# EAGLE schematic eggbothat2 (EAGLE 7.7.0)

## Sheet 1 of 2
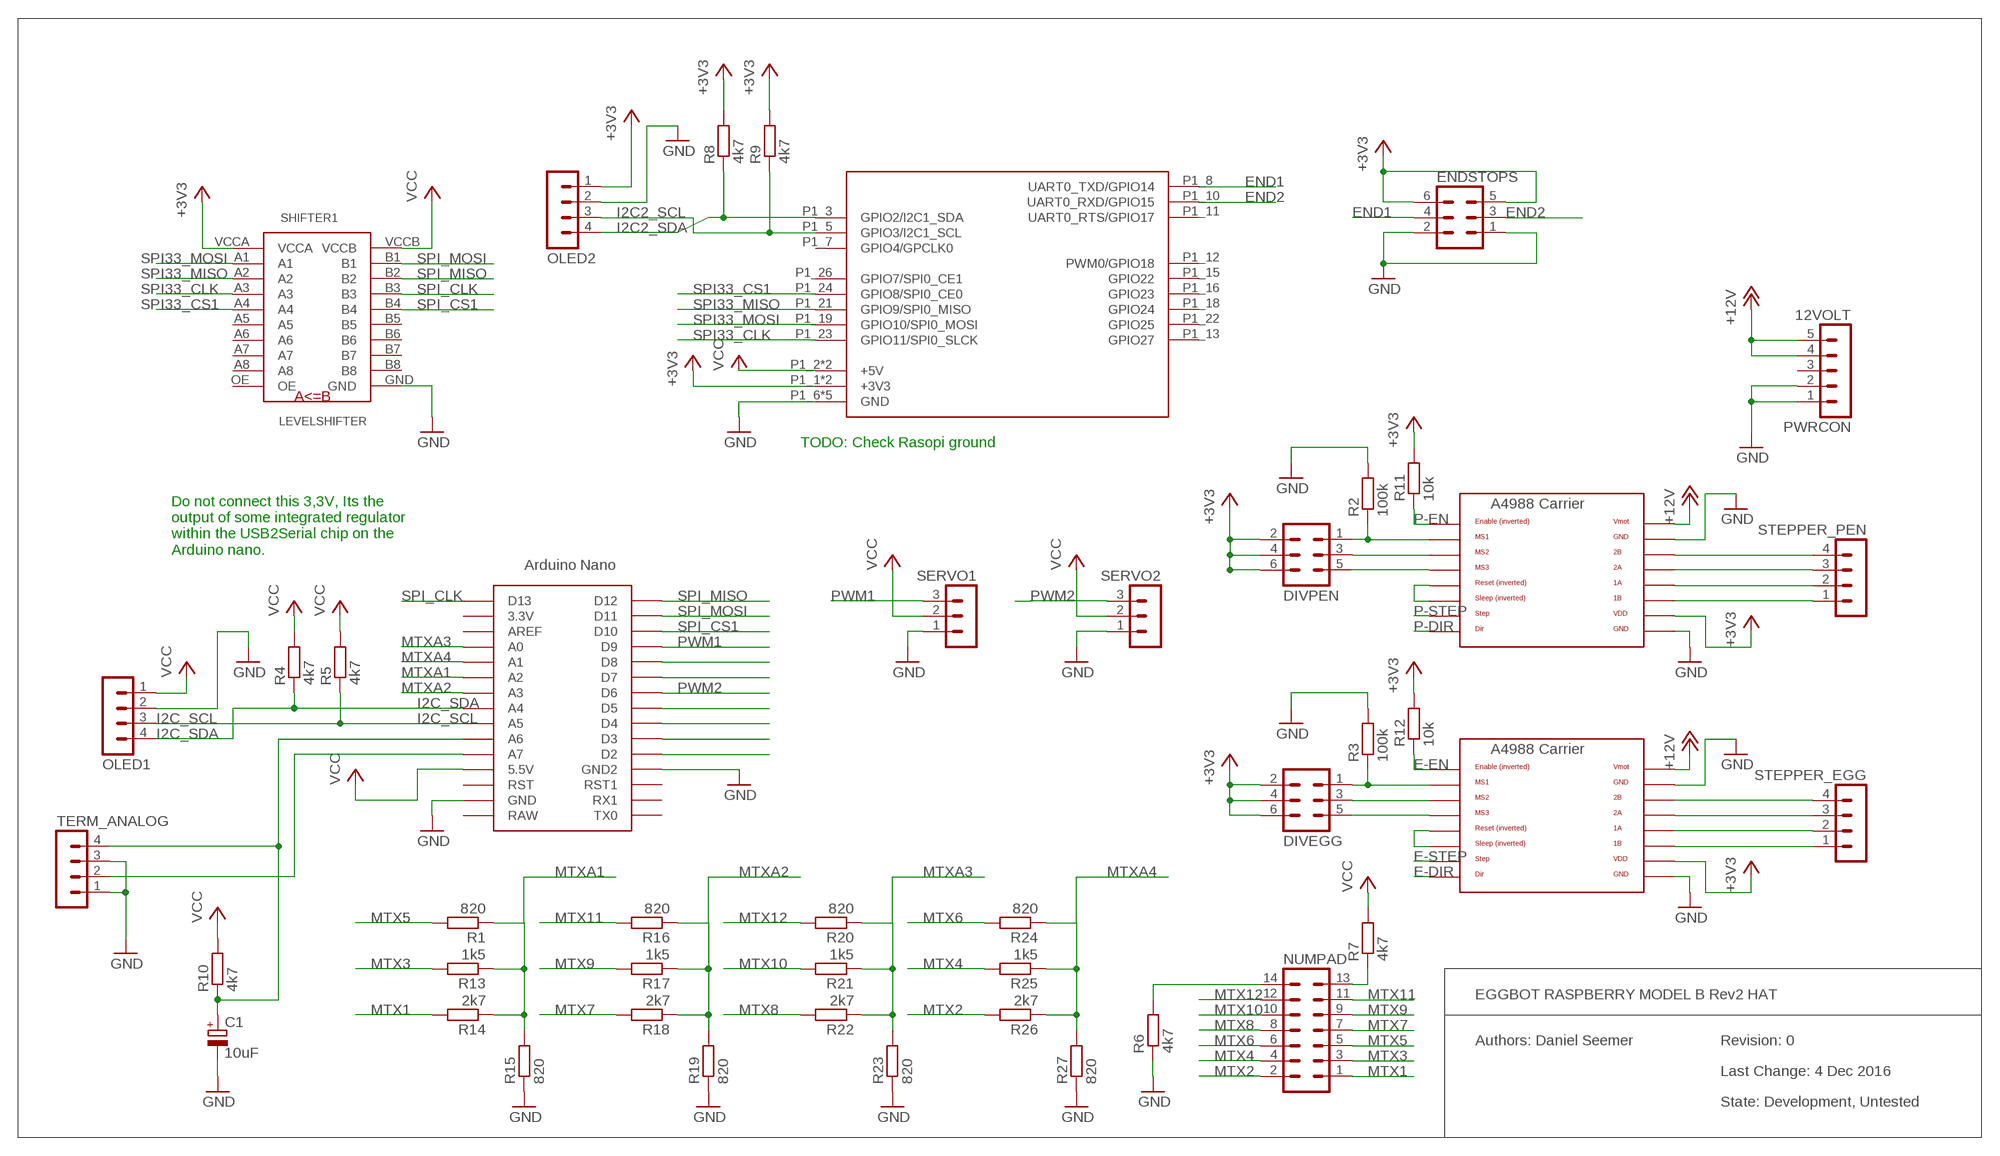
[diagram p0: schematic, sheet 1]

### Parts
12VOLT  PWRCON  MA05-1  [MA05-1]
C1  10uF  CPOL-EUE2.5-5  [E2,5-5]
DIVEGG  MA03-2  [MA03-2]
DIVPEN  MA03-2  [MA03-2]
ENDSTOPS  MA03-2  [MA03-2]
NUMPAD  MA07-2  [MA07-2]
OLED1  MA04-1  [MA04-1]
OLED2  MA04-1  [MA04-1]
R1  820  R-EU_R1206  [R1206]
R2  100k  R-EU_R1206  [R1206]
R3  100k  R-EU_R1206  [R1206]
R4  4k7  R-EU_R1206  [R1206]
R5  4k7  R-EU_R1206  [R1206]
R6  4k7  R-EU_R1206  [R1206]
R7  4k7  R-EU_R1206  [R1206]
R8  4k7  R-EU_R1206  [R1206]
R9  4k7  R-EU_R1206  [R1206]
R10  4k7  R-EU_R1206  [R1206]
R11  10k  R-EU_R1206  [R1206]
R12  10k  R-EU_R1206  [R1206]
R13  1k5  R-EU_R1206  [R1206]
R14  2k7  R-EU_R1206  [R1206]
R15  820  R-EU_R1206  [R1206]
R16  820  R-EU_R1206  [R1206]
R17  1k5  R-EU_R1206  [R1206]
R18  2k7  R-EU_R1206  [R1206]
R19  820  R-EU_R1206  [R1206]
R20  820  R-EU_R1206  [R1206]
R21  1k5  R-EU_R1206  [R1206]
R22  2k7  R-EU_R1206  [R1206]
R23  820  R-EU_R1206  [R1206]
R24  820  R-EU_R1206  [R1206]
R25  1k5  R-EU_R1206  [R1206]
R26  2k7  R-EU_R1206  [R1206]
R27  820  R-EU_R1206  [R1206]
RASPBERRY  RPI-B-V2SHIELD  [RPI-B-V2-SHIELD]
SERVO1  MA03-1  [MA03-1]
SERVO2  MA03-1  [MA03-1]
SHIFTER1  LEVELSHIFTER  [PLUG_20_S4]
STEPPER_EGG  MA04-1  [MA04-1]
STEPPER_PEN  MA04-1  [MA04-1]
TERM_ANALOG  MA04-1  [MA04-1]
U$1  A4988BREAKOUT  [A4988BREAKOUT]
U$2  A4988BREAKOUT  [A4988BREAKOUT]
U$4  NANO  [NANO]

### Nets
+3V3: DIVEGG.2 DIVEGG.4 DIVEGG.6 DIVPEN.2 DIVPEN.4 DIVPEN.6 ENDSTOPS.5 ENDSTOPS.6 OLED2.1 R8.2 R9.2 R11.2 R12.2 RASPBERRY.P1_1(+3V3) RASPBERRY.P1_17(+3V3) SHIFTER1.VCCA U$1.VDD U$2.VDD
+12V: 12VOLT.4 12VOLT.5 U$1.VMOT U$2.VMOT
E-DIR: U$2.DIR
E-EN: R12.1 U$2.EN
E-STEP: U$2.STEP
END1: ENDSTOPS.4 RASPBERRY.P1_8(UART0_TXD/GPIO14)
END2: ENDSTOPS.3 RASPBERRY.P1_10(UART0_RXD/GPIO15)
GND: 12VOLT.1 12VOLT.2 C1.- ENDSTOPS.1 ENDSTOPS.2 OLED1.2 OLED2.2 R2.2 R3.2 R6.1 R15.1 R19.1 R23.1 R27.1 RASPBERRY.P1_6(GND) RASPBERRY.P1_9(GND) RASPBERRY.P1_14(GND) RASPBERRY.P1_20(GND) RASPBERRY.P1_25(GND) SERVO1.1 SERVO2.1 SHIFTER1.GND TERM_ANALOG.1 TERM_ANALOG.3 U$1.GND U$1.GND@0(GND) U$2.GND U$2.GND@0(GND) U$4.GND U$4.GND1(GND2)
I2C2_SCL: OLED2.3 R9.1 RASPBERRY.P1_5(GPIO3/I2C1_SCL)
I2C2_SDA: OLED2.4 R8.1 RASPBERRY.P1_3(GPIO2/I2C1_SDA)
I2C_SCL: OLED1.3 R5.1 U$4.A5
I2C_SDA: OLED1.4 R4.1 U$4.A4
MTX1: NUMPAD.1 R14.2
MTX2: NUMPAD.2 R26.2
MTX3: NUMPAD.3 R13.2
MTX4: NUMPAD.4 R25.2
MTX5: NUMPAD.5 R1.2
MTX6: NUMPAD.6 R24.2
MTX7: NUMPAD.7 R18.2
MTX8: NUMPAD.8 R22.2
MTX9: NUMPAD.9 R17.2
MTX10: NUMPAD.10 R21.2
MTX11: NUMPAD.11 R16.2
MTX12: NUMPAD.12 R20.2
MTXA1: R1.1 R13.1 R14.1 R15.2 U$4.A2
MTXA2: R16.1 R17.1 R18.1 R19.2 U$4.A3
MTXA3: R20.1 R21.1 R22.1 R23.2 U$4.A0
MTXA4: R24.1 R25.1 R26.1 R27.2 U$4.A1
N$1: STEPPER_PEN.4 U$1.2B
N$2: STEPPER_PEN.3 U$1.2A
N$3: STEPPER_PEN.2 U$1.1A
N$4: STEPPER_PEN.1 U$1.1B
N$5: STEPPER_EGG.4 U$2.2B
N$6: STEPPER_EGG.3 U$2.2A
N$7: STEPPER_EGG.2 U$2.1A
N$8: STEPPER_EGG.1 U$2.1B
N$9: DIVPEN.3 U$1.MS2
N$10: DIVPEN.1 R2.1 U$1.MS1
N$11: DIVPEN.5 U$1.MS3
N$12: DIVEGG.3 U$2.MS2
N$13: DIVEGG.1 R3.1 U$2.MS1
N$14: DIVEGG.5 U$2.MS3
N$15: U$4.D8
N$16: NUMPAD.13 R7.1
N$17: NUMPAD.14 R6.2
N$18: U$1.RST U$1.SLP(SLEEP)
N$19: U$2.RST U$2.SLP(SLEEP)
N$20: C1.+ R10.1 TERM_ANALOG.4 U$4.A6
N$21: TERM_ANALOG.2 U$4.A7
N$22: U$4.D7
N$23: U$4.D5
N$24: U$4.D4
N$25: U$4.D3
N$26: U$4.D2
P-DIR: U$1.DIR
P-EN: R11.1 U$1.EN
P-STEP: U$1.STEP
PWM1: SERVO1.3 U$4.D9
PWM2: SERVO2.3 U$4.D6
SPI33_CLK: RASPBERRY.P1_23(GPIO11/SPI0_SLCK) SHIFTER1.A3
SPI33_CS1: RASPBERRY.P1_24(GPIO8/SPI0_CE0) SHIFTER1.A4
SPI33_MISO: RASPBERRY.P1_21(GPIO9/SPI0_MISO) SHIFTER1.A2
SPI33_MOSI: RASPBERRY.P1_19(GPIO10/SPI0_MOSI) SHIFTER1.A1
SPI_CLK: SHIFTER1.B3 U$4.D13
SPI_CS1: SHIFTER1.B4 U$4.D10
SPI_MISO: SHIFTER1.B2 U$4.D12
SPI_MOSI: SHIFTER1.B1 U$4.D11
VCC: OLED1.1 R4.2 R5.2 R7.2 R10.2 RASPBERRY.P1_2(+5V) RASPBERRY.P1_4(+5V) SERVO1.2 SERVO2.2 SHIFTER1.VCCB U$4.5V(5.5V)
Unconnected: 12VOLT.3 RASPBERRY.P1_7(GPIO4/GPCLK0) RASPBERRY.P1_11(UART0_RTS/GPIO17) RASPBERRY.P1_12(PWM0/GPIO18) RASPBERRY.P1_13(GPIO27) RASPBERRY.P1_15(GPIO22) RASPBERRY.P1_16(GPIO23) RASPBERRY.P1_18(GPIO24) RASPBERRY.P1_22(GPIO25) RASPBERRY.P1_26(GPIO7/SPI0_CE1) SHIFTER1.A5 SHIFTER1.A6 SHIFTER1.A7 SHIFTER1.A8 SHIFTER1.B5 SHIFTER1.B6 SHIFTER1.B7 SHIFTER1.B8 SHIFTER1.OE U$4.3.3V U$4.AREF U$4.RAW U$4.RST U$4.RST1 U$4.RX1 U$4.TX0

### Notes on the sheet
- TODO: Check Rasopi ground
- Do not connect this 3,3V, Its the
  output of some integrated regulator
  within the USB2Serial chip on the
  Arduino nano.
- EGGBOT RASPBERRY MODEL B Rev2 HAT
- Authors: Daniel Seemer | Revision: 0
- Last Change: 4 Dec 2016
- State: Development, Untested

## Sheet 2 of 2

## Library data of the parts
12VOLT = con-lstb:MA05-1: PIN HEADER; OC_FARNELL: unknown; OC_NEWARK: unknown
C1 = rcl:CPOL-EU: POLARIZED CAPACITOR, European symbol
DIVEGG DIVPEN ENDSTOPS = con-lstb:MA03-2: PIN HEADER; OC_FARNELL: unknown; OC_NEWARK: unknown
NUMPAD = con-lstb:MA07-2: PIN HEADER; OC_FARNELL: unknown; OC_NEWARK: unknown
OLED1 OLED2 STEPPER_EGG STEPPER_PEN TERM_ANALOG = con-lstb:MA04-1: PIN HEADER; OC_FARNELL: unknown; OC_NEWARK: unknown
R1-R27 = rcl:R-EU_: RESISTOR, European symbol
RASPBERRY = levelshifter:RPI-B-V2: Second revision of the Model 2 board including the P5 and P6 headers. Mounting holes have been added. Choose the "SHIELD" variant for a predefined Dimension layer and drilling holes. Theres also a "SHIELD" variant for the Model A without a RJ45 connector.
SERVO1 SERVO2 = con-lstb:MA03-1: PIN HEADER; OC_FARNELL: unknown; OC_NEWARK: unknown
SHIFTER1 = levelshifter:LEVELSHIFTER
U$1 U$2 = RepRapjr:A4988BREAKOUT
U$4 = levelshifter:NANO: Arduino Nano